# Altium project PCB_Project.PrjPCB
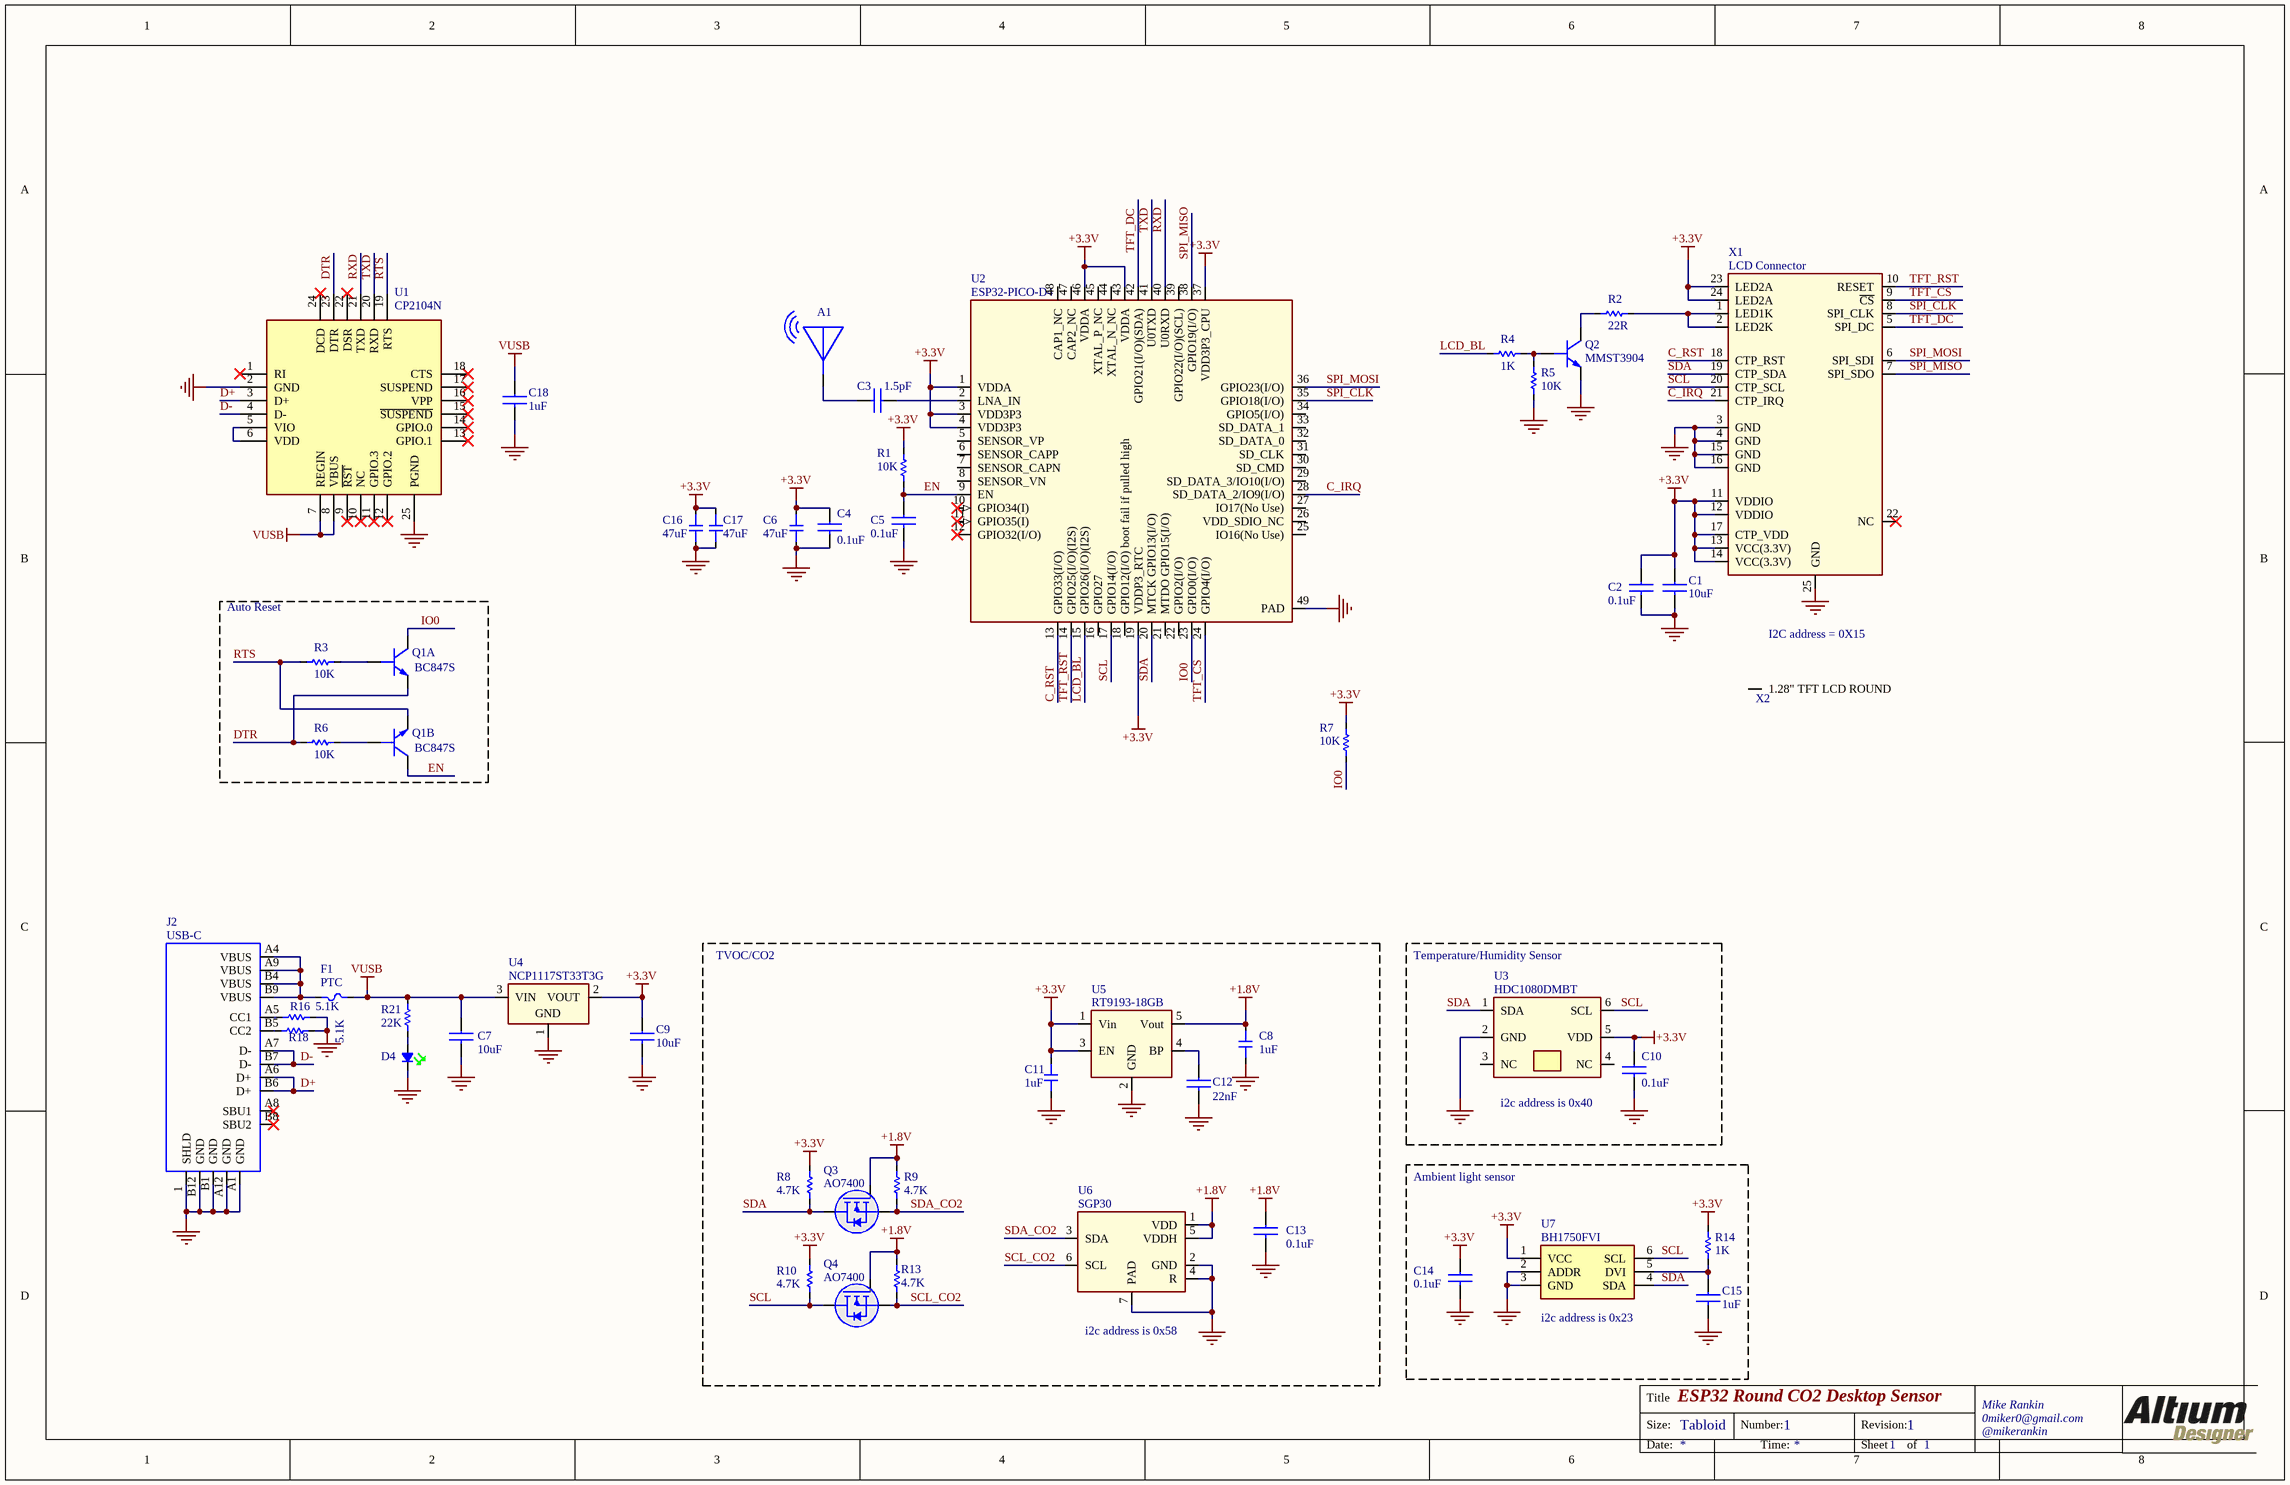
[diagram p0: Schematic_Rev1.SchDoc]
1 sheet, 50 parts. Net scope: global (net labels, ports and power ports of the same name join across sheets).
Board file: PCB_Rev1.PcbDoc

## Sheet Schematic_Rev1.SchDoc: ESP32 Round CO2 Desktop Sensor
size Tabloid; Date: Oct 15, 2022; DrawnBy: x; Engineer: x; Address1: Mike Rankin; Address2: 0miker0@gmail.com; Address3: @mikerankin; DocumentNumber: 1; Revision: 1; SheetNumber: 1; SheetTotal: 1; ImagePath: x

### Parts
A1  Antenna_Chip_1  [NN01-102]  (value not drawn)
C1  10uF  [CAPC2012X140N]
C2  0.1uF  [CAPC1005X56N]
C3  1.5pF  [CAPC1005X56N]
C4  0.1uF  [CAPC1005X56N]
C5  0.1uF  [CAPC1005X56N]
C6  47uF  [CAPC3225X160N]
C7  10uF  [CAPC2012X140N]
C8  1uF  [CAPC1608X09L]
C9  10uF  [CAPC2012X140N]
C10  0.1uF  [CAPC1005X56N]
C11  1uF  [CAPC1608X09L]
C12  22nF  [CAPC1005X56N]
C13  0.1uF  [CAPC1005X56N]
C14  0.1uF  [CAPC1005X56N]
C15  1uF  [CAPC1005X56N]
C16  47uF  [CAPC3225X160N]
C17  47uF  [CAPC3225X160N]
C18  1uF  [CAPC1005X56N]
D4  Green Led  [LED1005X40N-Green]  (value not drawn)
F1  PTC  [RESC1608X06L (0603 FOOTPRINT)]
J2  USB-C  [TYPE-C-31-M-12]
Q1  BC847S  [SOT65P210X110-6N]  (parts A,B of 2)
Q2  MMST3904  [SC-70]
Q3  AO7400  [SC-70]
Q4  AO7400  [SC-70]
R1  10K  [RESC1005X40L]
R2  22R  [RESC1005X40L]
R3  10K  [RESC1005X40L]
R4  1K  [RESC1005X40L]
R5  10K  [RESC1005X40L]
R6  10K  [RESC1005X40L]
R7  10K  [RESC1005X40L]
R8  4.7K  [RESC1005X40L (0402 FOOTPRINT)]
R9  4.7K  [RESC1005X40L (0402 FOOTPRINT)]
R10  4.7K  [RESC1005X40L (0402 FOOTPRINT)]
R13  4.7K  [RESC1005X40L (0402 FOOTPRINT)]
R14  1K  [RESC1005X40L (0402 FOOTPRINT)]
R16  5.1K  [RESC1005X40L]
R18  5.1K  [RESC1005X40L]
R21  22K  [RESC1005X40L]
U1  CP2104N  [24-QFN]
U2  ESP32-PICO-D4  [QFN48_NEWEST 0.5mm pitch]
U3  HDC1080DMBT  [HDC1080]
U4  NCP1117ST33T3G  [SOT230P700X180-4N]
U5  1.8V LDO  [SOT95P280X144-5N]  (value not drawn)
U6  SGP30  [DFN-6 (2.45mm X 2.45mm)]
U7  BH1750FVI  [WSOF-6]
X1  LCD Connector  [BM10NB(0.8)-24DS-0.4V(51)]
X2  TFT_1.28 inch  (value not drawn)

### Blocks framed on the sheet
Auto Reset: Q1 R3 R6

### Nets
+1.8V: C8.1 C13.1 Q3.1(G) Q4.1(G) R9.2 R13.2 U5.5(Vout) U6.1(VDD) U6.5(VDDH)
+3.3V: C1.1 C2.1 C4.1 C6.1 C9.1 C10.1 C11.1 C14.1 C16.1 C17.1 R1.1 R7.1 R8.2 R10.2 R14.2 U2.1(VDDA) U2.3(VDD3P3) U2.4(VDD3P3) U2.19(VDDP3_RTC) U2.37(VDD3P3_CPU) U2.43(VDDA) U2.46(VDDA) U3.5(VDD) U4.2(VOUT) U5.1(Vin) U5.3(EN) U7.1(VCC) X1.11(VDDIO) X1.12(VDDIO) X1.13(VCC(3.3V)) X1.14(VCC(3.3V)) X1.17(CTP_VDD) X1.23(LED2A) X1.24(LED2A)
GND: C1.2 C2.2 C4.2 C5.2 C6.2 C7.2 C8.2 C9.2 C10.2 C11.2 C12.2 C13.2 C14.2 C15.2 C16.2 C17.2 C18.2 D4.1 J2.1(SHLD) J2.A1(GND) J2.A12(GND) J2.B1(GND) J2.B12(GND) Q2.2(E) R5.2 R16.2 R18.2 U1.2(GND) U1.25(PGND) U2.49(PAD) U3.2(GND) U4.1(GND) U5.2(GND) U6.2(GND) U6.4(R) U6.7(PAD) U7.2(ADDR) U7.3(GND) X1.3(GND) X1.4(GND) X1.15(GND) X1.16(GND) X1.25(GND)
VUSB: C7.1 C18.1 F1.1 R21.2 U1.7(REGIN) U1.8(VBUS) U4.3(VIN)
C_IRQ: U2.28(SD_DATA_2/IO9(I/O)) X1.21(CTP_IRQ)
C_RST: U2.13(GPIO33(I/O)) X1.18(CTP_RST)
D+: J2.A6(D+) J2.B6(D+) U1.3(D+)
D-: J2.A7(D-) J2.B7(D-) U1.4(D-)
DTR: Q1.1(E1) R6.2 U1.23(DTR)
EN: C5.1 Q1.3(C2) R1.2 U2.9(EN)
IO0: Q1.6(C1) R7.2 U2.23(GPIO0(I/O))
LCD_BL: R4.1 U2.15(GPIO26(I/O)(I2S))
RTS: Q1.4(E2) R3.2 U1.19(RTS)
RXD: U1.21(TXD) U2.40(U0RXD)
SCL: Q4.3(D) R10.1 U2.17(GPIO14(I/O)) U3.6(SCL) U7.6(SCL) X1.20(CTP_SCL)
SCL_CO2: Q4.2(S) R13.1 U6.6(SCL)
SDA: Q3.3(D) R8.1 U2.20(MTCK_GPIO13(I/O)) U3.1(SDA) U7.4(SDA) X1.19(CTP_SDA)
SDA_CO2: Q3.2(S) R9.1 U6.3(SDA)
SPI_CLK: U2.35(GPIO18(I/O)) X1.8(SPI_CLK)
SPI_MISO: U2.38(GPIO19(I/O)) X1.7(SPI_SDO)
SPI_MOSI: U2.36(GPIO23(I/O)) X1.6(SPI_SDI)
TFT_CS: U2.24(GPIO4(I/O)) X1.9(~{CS})
TFT_DC: U2.42(GPIO21(I/O)(SDA)) X1.5(SPI_DC)
TFT_RST: U2.14(GPIO25(I/O)(I2S)) X1.10(RESET)
TXD: U1.20(RXD) U2.41(U0TXD)
NetA1_1: A1.1 C3.2
NetC3_1: C3.1 U2.2(LNA_IN)
NetC12_1: C12.1 U5.4(BP)
NetC15_1: C15.1 R14.1 U7.5(DVI)
NetD4_2: D4.2 R21.1
NetF1_2: F1.2 J2.A4(VBUS) J2.A9(VBUS) J2.B4(VBUS) J2.B9(VBUS)
NetJ2_A5: J2.A5(CC1) R16.1
NetJ2_B5: J2.B5(CC2) R18.1
NetQ1_2: Q1.2(B1) R3.1
NetQ1_5: Q1.5(B2) R6.1
NetQ2_1: Q2.1(B) R4.2 R5.1
NetQ2_3: Q2.3(C) R2.2
NetR2_1: R2.1 X1.1(LED1K) X1.2(LED2K)
NetU1_5: U1.5(VIO) U1.6(VDD)

Not connected (* = marked no-connect by the designer): J2 A8(SBU1)* B8(SBU2)*; U1 1(RI)* 9(~{RST})* 10(NC)* 11(GPIO.3)* 12(GPIO.2)* 13(GPIO.1)* 14(GPIO.0)* 15(~{SUSPEND})* 16(VPP)* 17(SUSPEND)* 18(CTS)* 22(DSR)* 24(DCD)*; U2 5(SENSOR_VP) 6(SENSOR_CAPP) 7(SENSOR_CAPN) 8(SENSOR_VN) 10(GPIO34(I))* 11(GPIO35(I))* 12(GPIO32(I/O))* 16(GPIO27) 18(GPIO12(I/O)_boot_fail_if_pulled_high) 21(MTDO_GPIO15(I/O)) 22(GPIO2(I/O)) 25(IO16(No_Use)) 26(VDD_SDIO_NC) 27(IO17(No_Use)) 29(SD_DATA_3/IO10(I/O)) 30(SD_CMD) 31(SD_CLK) 32(SD_DATA_0) 33(SD_DATA_1) 34(GPIO5(I/O)) 39(GPIO22(I/O)(SCL)) 44(XTAL_N_NC) 45(XTAL_P_NC) 47(CAP2_NC) 48(CAP1_NC); U3 3(NC) 4(NC); X1 22(NC)*; X2 1(1.28"_TFT_LCD_ROUND)

### Notes on the sheet
- I2C address = 0X15
- TVOC/CO2
- (near U3) Temperature/Humidity Sensor
- i2c address is 0x40
- Ambient light sensor
- (near U6) i2c address is 0x58
- (near U7) i2c address is 0x23
- Title
- Size:
- Tabloid
- Number:
- Revision:
- Date:
- Time:
- Sheet
- of

### Library data of the parts
A1 = Antenna_Chip_1: Antenna Chip 2.4Gig; Manufacturer: Rainsun; Part_Number: C99665; Value: Chip Antenna; Vendor: LCSC
C1 C7 C9 = CAP_0805: CAP 10uF 0805; Part_Footprint: 0805; Value: 10uF
C2 C4 C5 C10 C13 C14 = CAP_0402: CAP 0.1uF 0402; Part_Footprint: 0402; Value: 0.1uF
C3 = CAP_0402: CAP 1.5pF 0402; Part_Footprint: 0402; Value: 1.5pF
C6 C16 C17 = CAP_1210: CAP 47uF 1210; Part_Footprint: 1210; Value: 47uF
C8 C11 = CAP_0603: CAP 1uF 0603; Part_Footprint: 0603; Value: 1uF
C12 = CAP_0402: CAP 22nF 0402; Part_Footprint: 0402; Value: 22nF
C15 C18 = CAP_0603: CAP 1uF 16V 0402; Part_Footprint: 0402; Value: 1uF
D4 = LED_0402_SMALL_GREEN: LED Green 0402; Part_Number: C74338; Part_Footprint: 0402; Vendor: LCSC; Value: Green Led
F1 = PTC_FUSE_0603: PTC FUSE 0.5mA hold, 1A trip 0603; Manufacturer: JDT Fuse; Part_Number: C2982257; Vendor: LCSC; Value: PTC
J2 = USB-C: CONN RECPT USB-C; Manufacturer: KHE; Part_Number: C165948; Part_Footprint: SMT; Vendor: LCSC; Value: USB-C
Q1 = BC847S: TRANS 2NPN 44V 0.1A SC-70-6; Manufacturer: Changjiang; Vendor: LCSC; Part_Number: BC847S; Value: 2NPN
Q2 = MMST3904: TRANSISTOR NPN GP 40V SC-70; Manufacturer: Changjiang; Part_Number: C54879; Vendor: LCSC; Part_Footprint: SC-70; Value: MMST3904
Q3 Q4 = AO7400: MOSFET N-CH 20V 4A SC70-3; Manufacturer: VBSemi Elec; Vendor: LCSC; Part_Footprint: SC70-3; Part_Number: AO7400; Value: AO7400
R1 R3 R5-R7 = RES_0402: RES 10K 0402; Part_Footprint: 0402; Value: 10K
R2 = RES_0402: RES 22R 0402; Part_Footprint: 0402; Value: 22R
R4 R14 = RES_0402: RES 1K 0402; Part_Footprint: 0402; Value: 1K
R8-R10 R13 = RES_0402: RES 4.7K 0402; Part_Footprint: 0402; Value: 4.7K
R16 R18 = RES_0603: RES 5.1K 0402; Part_Footprint: 0402; Value: 5.1K
R21 = RES_0603: RES 22K 0402; Part_Footprint: 0402; Value: 22K
U1 = CP2104N: IC BRIDGE USB TO UART 24QFN; Manufacturer: Silicon Labs; Part_Number: C47742; Vendor: LCSC; Part_Footprint: 24QFN; Value: CP2104N
U2 = ESP32-PICO-D4: WIFI/Bluetooth, QFN-48 7x7; Manufacturer: Espressif; Part_Number: C193707; Part_Footprint: QFN48; Vendor: LCSC; Value: ESP32-PICO-D4
U3 = HDC1080DMBT: Humidity/Temperature Sensor; Manufacturer: Texas Instruments; Part_Number: C82227; Vendor: LCSC; Value: HDC1080DMBT
U4 = NCP1117ST33T3G: IC REG LDO 1.0A 3.3V SOT-223; Manufacturer: On Semi; Part_Number: C26537; Vendor: LCSC; Value: 3.3V LDO; Part_Footprint: SOT-223
U5 = RT9193-18GB: IC REG LDO 1.8V 300mA SOT23-5; Manufacturer: Richtek USA; Vendor: Digi-Key; Part_Footprint: SOT23-5; Part_Number: RT9193-18GB; Value: 1.8V LDO
U6 = SGP30: TVOC/CO2 Sensor; Manufacturer: Sensirion AG; Part_Footprint: 6-DFN; Part_Number: SGP30-2.5K; Vendor: LCSC; Value: SGP30
U7 = BH1750FVI: Optical Sensor Ambient I2C 6-SMD; Manufacturer: Rohm; Part_Footprint: 6WSOF; Part_Number: C78960; Vendor: LCSC; Value: BH1750FVI
X1 = FFC, FPC 24 pin 0.5mm Con 1.28" TFT: FFC, FPC 24 pin 0.4mm Connector for 1.28" TFT; Manufacturer: Hirose; Part_Footprint: SMD; Vendor: Digi-Key; Part_Number: BM10NB(0.8)-24DS-0.4V(51); Value: LCD Connector
X2 = TFT_GLASS 1.28 Inch Round: 1.28 INCH TFT GLASS ROUND; Part_Number: ER-TFT1.28-2; Manufacturer: BuyDisplay; Vendor: BuyDisplay; Value: *; Part_Footprint: *